# Altium schematic sheet 主板6.SchDoc
size A4
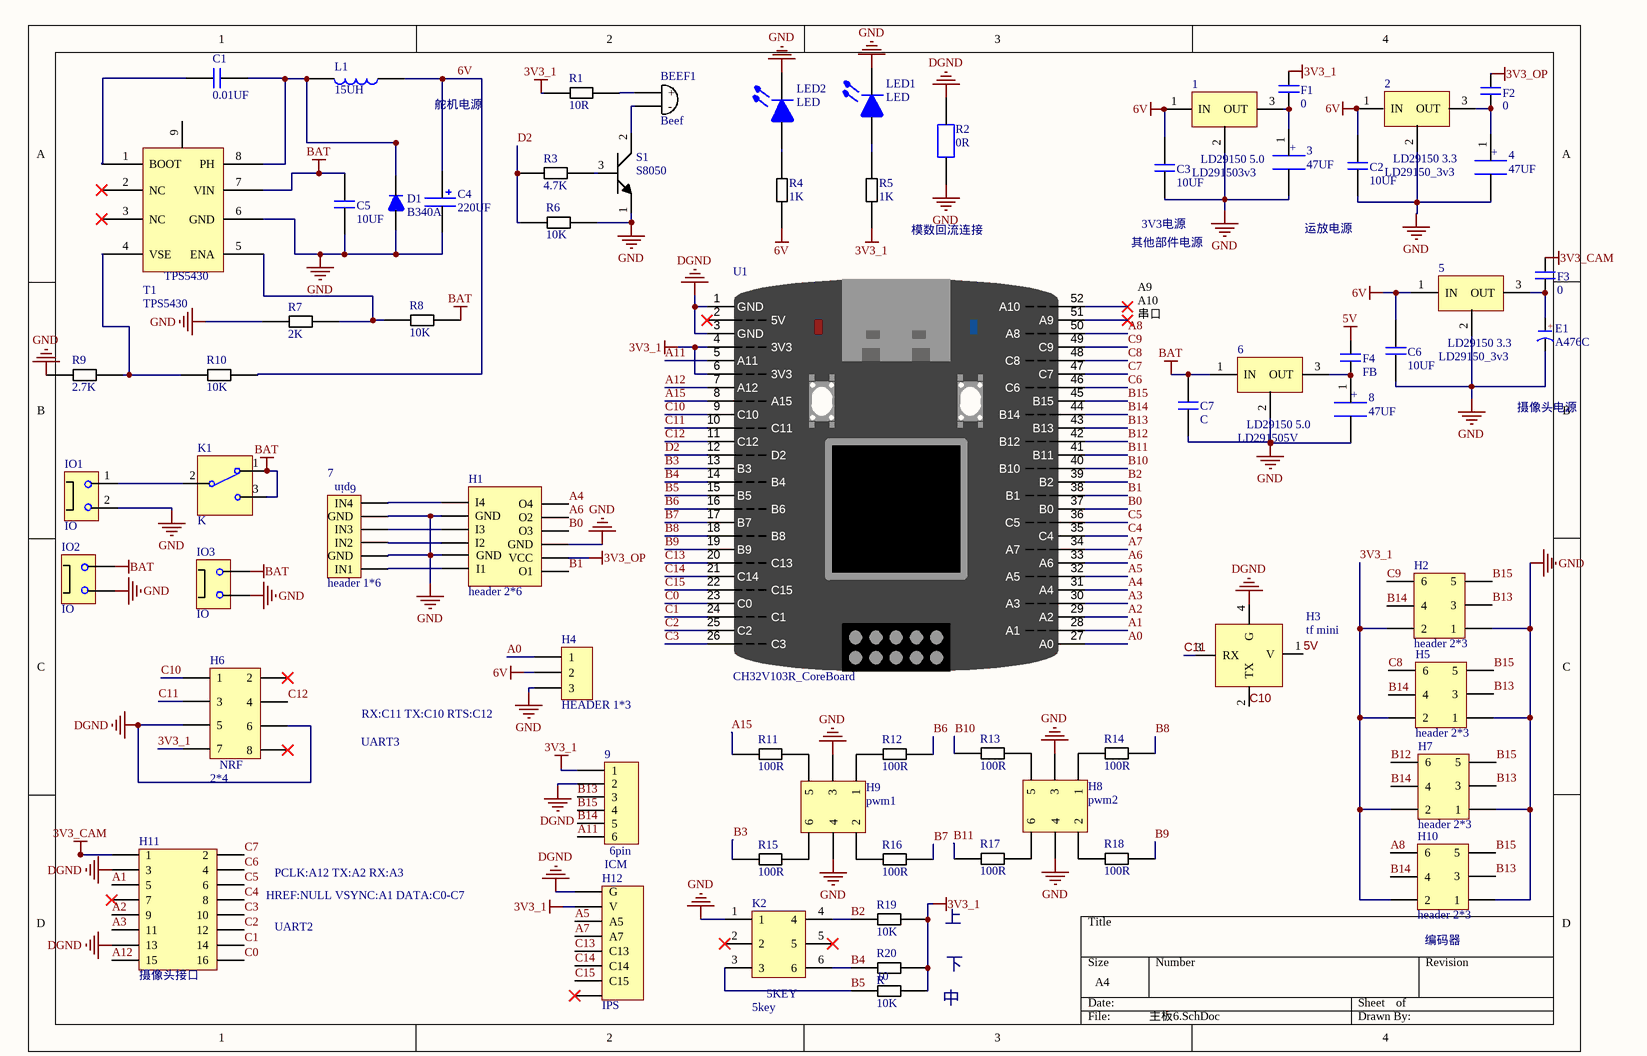
[diagram p0: 主板6.SchDoc]

## Parts
1  LD291503v3  [LD29150]
2  LD29150_3v3  [LD29150]
3  47UF  [CD A(3216)]
4  47UF  [CD A(3216)]
5  LD29150_3v3  [LD29150]
6  LD291505V  [LD29150]
7  header 1*6  [HDR2.54-LI-6P]
8  47UF  [CD A(3216)]
9  ICM  [HDR2.54-LI-6P]
10  10K  [0603-R]
BEEF1  Beef  [BEEF]
C1  0.01UF  [C 0603_L]
C2  10UF  [C 0603_L]
C3  10UF  [C 0603_L]
C4  220UF  [CAP 2.5*6.3*7]
C5  10UF  [C 0603_L]
C6  10UF  [C 0603_L]
C7  C  [C 0603_L]
D1  B340A  [SMA]
E1  A476C  [CD A(3216)]
F1  0  [0603-C]
F2  0  [0603-C]
F3  0  [0603-C]
F4  FB  [0603-C]
H1  header 2*6  [OP]
H2  header 2*3  [HDR2.54-LI-2x3P]
H3  tf mini  [GH1.25]
H4  HEADER 1*3  [HDR2.54-LI-3P]
H5  header 2*3  [HDR2.54-LI-2x3P]
H6  2*4  [HDR2.54-LI-2x4P]
H7  header 2*3  [HDR2.54-LI-2x3P]
H8  pwm2  [HDR2.54-LI-2x3P]
H9  pwm1  [HDR2.54-LI-2x3P]
H10  header 2*3  [HDR2.54-LI-2x3P]
H11  摄像头接口  [HDR2.54-LI-2x8P]
H12  IPS  [HDR2.54-M-LI-8P]
IO1  IO  [XT30]
IO2  IO  [XT30]
IO3  IO  [XT30]
K1  K  [SW-SPDT-3A250V]
K2  5key  [5KEY]
L1  15UH  [L-SMD-7]
LED1  LED  [0603-LED-R]
LED2  LED  [0603-LED-R]
R1  10R  [0603-R]
R2  0R  [0603-C]
R3  4.7K  [0603-R]
R4  1K  [0603-R]
R5  1K  [0603-R]
R6  10K  [0603-R]
R7  2K  [0603-R]
R8  10K  [0603-R]
R9  2.7K  [0603-R]
R10  10K  [0603-R]
R11  100R  [0603-R]
R12  100R  [0603-R]
R13  100R  [0603-R]
R14  100R  [0603-R]
R15  100R  [0603-R]
R16  100R  [0603-R]
R17  100R  [0603-R]
R18  100R  [0603-R]
R19  10K  [0603-R]
R20  R  [0603-R]
S1  S8050  [SOT-23-3_L2.9-W1.3-P1.90-LS2.4-BR - duplicate]
T1  TPS5430  [TPS5430]
U1  CH32V103R_CoreBoard  [CH32V103R_CoreBoard]

## Nets
3V3_1: 9.1 10.2 F1.2 H2.2 H5.2 H6.7 H7.2 H10.2 H12.2(V) R1.1 R5.1 R19.2 R20.2 U1.4(3V3) U1.6(3V3)
3V3_CAM: F3.1 H11.1
3V3_OP: F2.1 H1.8(VCC)
5V: F4.2 H3.1(V)
6V: 1.1(IN) 2.1(IN) 5.1(IN) C2.2 C3.1 C4.1 C6.2 H4.2 L1.2 R4.1 R10.2
BAT: 6.1(IN) C5.2 C7.2 IO2.1 IO3.1 K1.1 K1.3 R8.2 T1.7(VIN)
DGND: 9.2 H3.4(G) H6.5 H6.6 H11.3 H11.13 H12.1(G) R2.2 U1.1(GND) U1.3(GND)
GND: 1.2(GND) 2.2(GND) 3.2 4.2 5.2(GND) 6.2(GND) 7.2(GND) 7.5(GND) 8.2 C2.1 C3.2 C4.2 C5.1 C6.1 C7.1 D1.1(A) E1.2(K) H1.2(GND) H1.5(GND) H1.9(GND) H2.1 H4.3 H5.1 H7.1 H8.3 H8.4 H9.3 H9.4 H10.1 IO1.2 IO2.2 IO3.2 K2.1 LED1.LED- LED2.LED- R2.1 R6.2 R7.1 R9.1 S1.1 T1.6(GND)
A0: H4.1 U1.27(A0)
A1: H11.5 U1.28(A1)
A2: H11.9 U1.29(A2)
A3: H11.11 U1.30(A3)
A4: H1.12(O4) U1.31(A4)
A5: H12.3(A5) U1.32(A5)
A6: H1.10(O2) U1.33(A6)
A7: H12.4(A7) U1.34(A7)
A8: H10.6 U1.50(A8)
A11: 9.6 U1.5(A11)
A12: H11.15 U1.7(A12)
A15: R11.1 U1.8(A15)
B0: H1.11(O3) U1.37(B0)
B1: H1.7(O1) U1.38(B1)
B2: K2.4 R19.1 U1.39(B2)
B3: R15.1 U1.13(B3)
B4: K2.6 R20.1 U1.14(B4)
B5: 10.1 K2.3 U1.15(B5)
B6: R12.2 U1.16(B6)
B7: R16.2 U1.17(B7)
B8: R14.2 U1.18(B8)
B9: R18.2 U1.19(B9)
B10: R13.1 U1.40(B10)
B11: R17.1 U1.41(B11)
B12: H7.6 U1.42(B12)
B13: 9.3 H2.3 H5.3 H7.3 H10.3 U1.43(B13)
B14: 9.5 H2.4 H5.4 H7.4 H10.4 U1.44(B14)
B15: 9.4 H2.5 H5.5 H7.5 H10.5 U1.45(B15)
C0: H11.16 U1.23(C0)
C1: H11.14 U1.24(C1)
C2: H11.12 U1.25(C2)
C3: H11.10 U1.26(C3)
C4: H11.8 U1.35(C4)
C5: H11.6 U1.36(C5)
C6: H11.4 U1.46(C6)
C7: H11.2 U1.47(C7)
C8: H5.6 U1.48(C8)
C9: H2.6 U1.49(C9)
C10: H3.2(TX) H6.1 U1.9(C10)
C11: H3.3(RX) H6.3 U1.10(C11)
C12: H6.4 U1.11(C12)
C13: H12.5(C13) U1.20(C13)
C14: H12.6(C14) U1.21(C14)
C15: H12.7(C15) U1.22(C15)
D2: R3.1 R6.1 U1.12(D2)
Net1_3: 1.3(OUT) 3.1(+) F1.1
Net2_3: 2.3(OUT) 4.1(+) F2.2
Net5_3: 5.3(OUT) E1.1(A) F3.2
Net6_3: 6.3(OUT) 8.1(+) F4.1
Net7_1: 7.1(IN1) H1.6(I1)
Net7_3: 7.3(IN2) H1.4(I2)
Net7_4: 7.4(IN3) H1.3(I3)
Net7_6: 7.6(IN4) H1.1(I4)
NetBEEF1_1: BEEF1.1(+) R1.2
NetBEEF1_2: BEEF1.2(-) S1.2
NetC1_1: C1.1 T1.1(BOOT)
NetC1_2: C1.2 D1.2(K) L1.1 T1.8(PH)
NetH8_1: H8.1 R14.1
NetH8_2: H8.2 R18.1
NetH8_5: H8.5 R13.2
NetH8_6: H8.6 R17.2
NetH9_1: H9.1 R12.1
NetH9_2: H9.2 R16.1
NetH9_5: H9.5 R11.2
NetH9_6: H9.6 R15.2
NetIO1_1: IO1.1 K1.2
NetLED1_LED+: LED1.LED+ R5.2
NetLED2_LED+: LED2.LED+ R4.2
NetR3_2: R3.2 S1.3
NetR7_2: R7.2 R8.1 T1.5(ENA)
NetR9_2: R9.2 R10.1 T1.4(VSE)

Not connected (* = marked no-connect by the designer): H6 2* 8*; H11 7*; H12 8*; K2 2* 5*; T1 2(NC)* 3(NC)* 9; U1 2(5V)* 51(A9)* 52(A10)*

## Notes on the sheet
- 舵机电源
- 模数回流连接
- 其他部件电源
- (near C3) 3V3电源
- 运放电源
- A9 A10 串口
- 摄像头电源
- RX:C11 TX:C10 RTS:C12
- UART3
- PCLK:A12 TX:A2 RX:A3
- (near H11) HREF:NULL VSYNC:A1 DATA:C0-C7
- UART2
- 上
- (near H10) 编码器
- 中
- 下
- (in symbol 5key) 5KEY
- (in symbol C-CD) +
- (in symbol header 1*6) 6pin
- (in symbol LD29150_3v3) LD29150 3.3
- (in symbol LD291505V) LD29150 5.0

## Library data of the parts
1 6 = LD291505V: 5v转压
2 5 = LD29150_3v3: 转压3v3
3 4 8 = 钽电容
7 = header 1*6: ICM
9 = header 1*6
10 R1 R3-R20 = R: 电阻
BEEF1 = Beef: 蜂鸣器
C1-C3 C5-C7 = C: 陶瓷电容
C4 = C+: 有极电容
D1 = D: 二极管
E1 = C-CD: 贴片钽电容; 版权归属: 源创客; BOM名称: 贴片钽电容; 学习资源: www.ooocke.com
F1-F4 = FB: 0欧磁珠
H1 = header 2*6: 运放接口
H2 H5 H7-H10 = header 2*3: 编码器，PWM
H3 = HEADER 4
H4 = HEADER 1*3: 舵机
H6 = 2*4: NRF
H11 = Header 2*8
H12 = HEADER 8: 屏幕
IO1-IO3 = IO: 接口
K1 = K: 开关
L1 = L: 电感
R2 = R0: 0欧电阻
S1 = S8050: 三极管
T1 = TPS5430: 转压8转6v
U1 = CH32V103R_CoreBoard: 逐飞科技 CH32V103R核心板